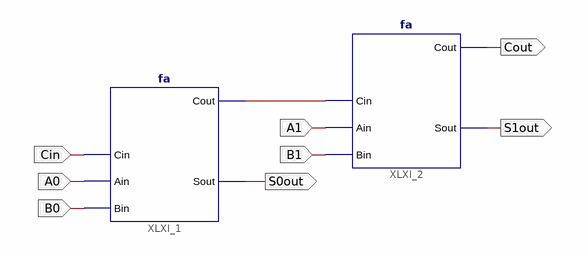
[diagram p0: schematic sheet 1]
// Xilinx ISE schematic adder2b.sch (spartan3e) as structural Verilog: 2 symbols, 8 ports
module adder2b (
  input  A0,
  input  B0,
  input  A1,
  input  B1,
  input  Cin,
  output S0out,
  output Cout,
  output S1out
);

  wire XLXN_8;

  fa XLXI_1 (.Cin(Cin), .Cout(XLXN_8), .Ain(A0), .Bin(B0), .Sout(S0out));
  fa XLXI_2 (.Cin(XLXN_8), .Cout(Cout), .Ain(A1), .Bin(B1), .Sout(S1out));
endmodule
